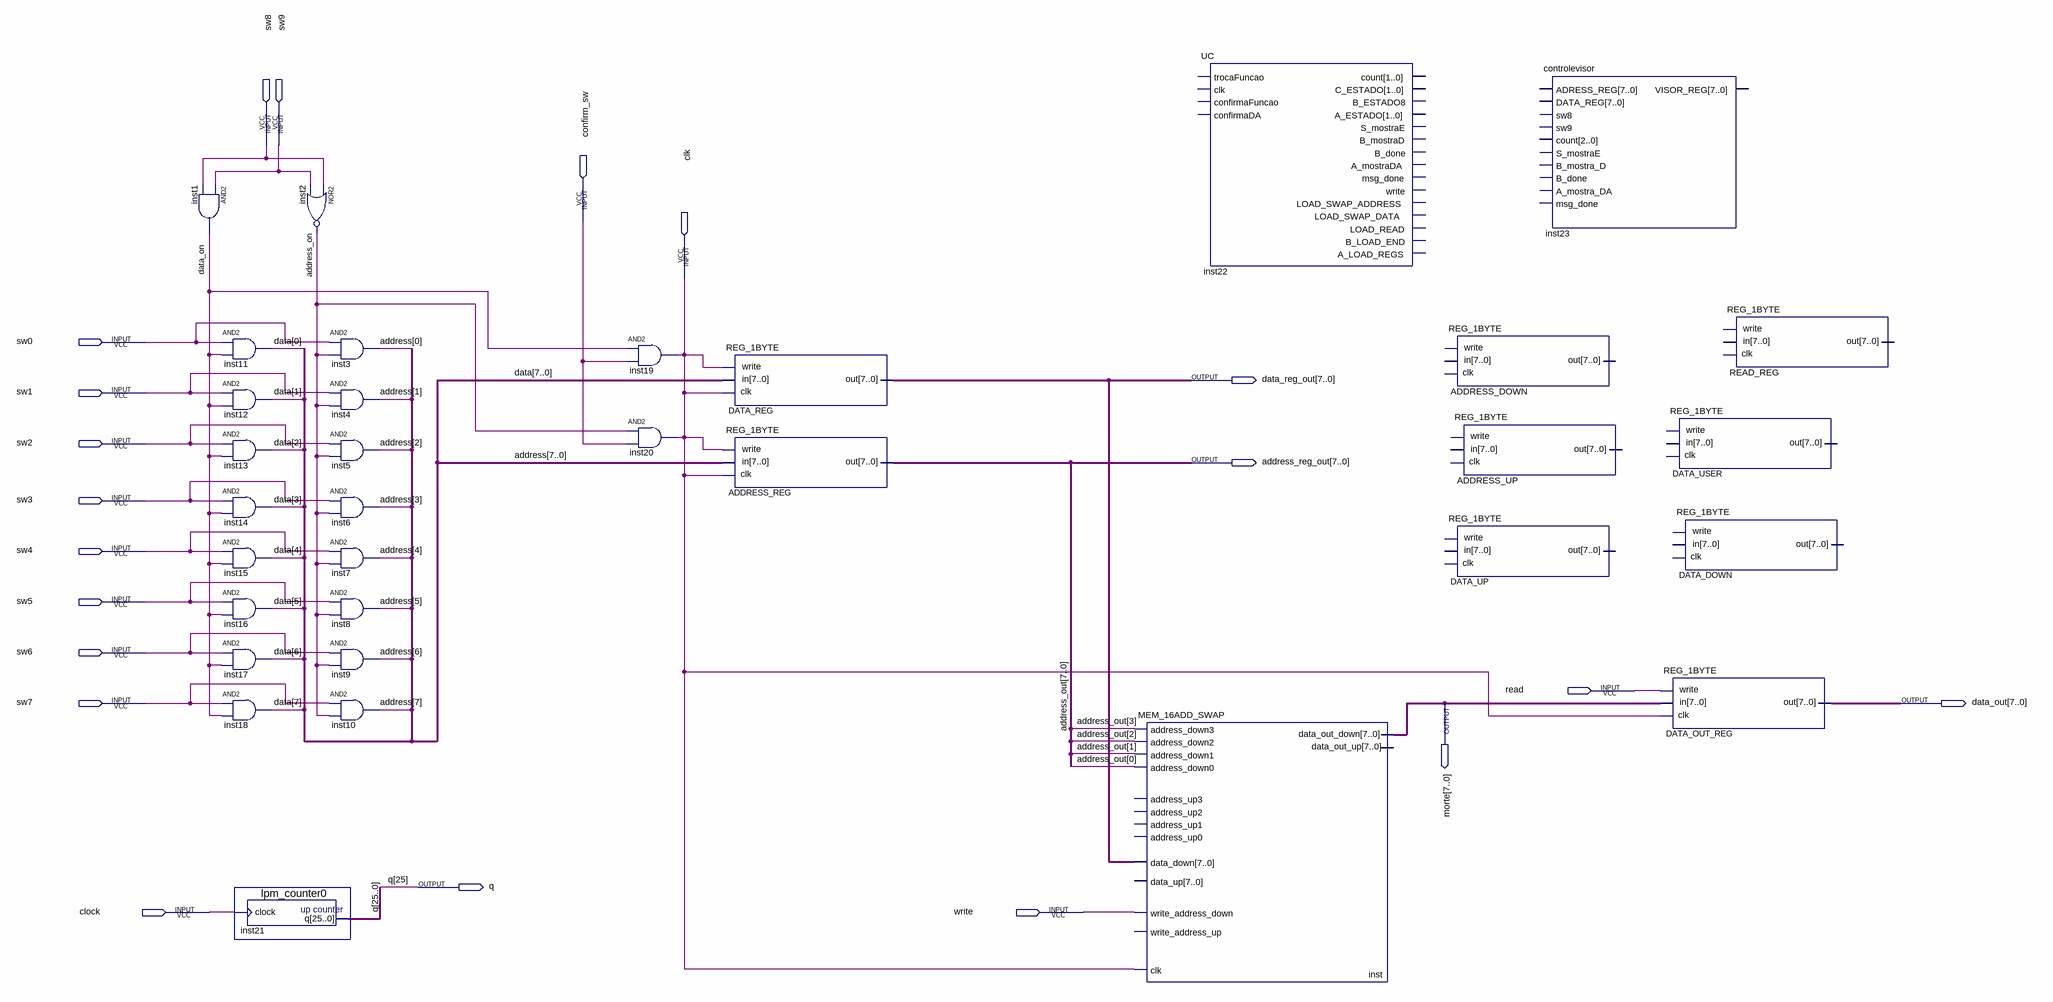
[diagram p0: schematic sheet]
// Quartus schematic trabalhofinal_swap.bdf as structural Verilog: 33 symbols, 20 pins
module trabalhofinal_swap (
  input  sw8,
  input  sw9,
  input  confirm_sw,
  input  clk,
  input  sw0,
  input  sw1,
  input  sw2,
  input  sw3,
  input  sw4,
  input  sw5,
  input  sw6,
  input  read,
  input  sw7,
  input  clock,
  input  write,
  output [7:0] data_reg_out,
  output [7:0] address_reg_out,
  output [7:0] morte,
  output [7:0] data_out,
  output q
);

  wire address_on, data_on;
  wire [7:0] address, data;
  wire [24:0] q_bus;

  and inst1 (data_on, sw9, sw8);
  and inst11 (data[0], sw0, data_on);
  and inst12 (data[1], sw1, data_on);
  and inst13 (data[2], sw2, data_on);
  and inst14 (data[3], sw3, data_on);
  and inst15 (data[4], sw4, data_on);
  and inst16 (data[5], sw5, data_on);
  and inst17 (data[6], sw6, data_on);
  and inst18 (data[7], sw7, data_on);
  lpm_counter0 inst21 (.clock(clock), .q({q, q_bus}));
  nor inst2 (address_on, sw8, sw9);
  and inst3 (address[0], sw0, address_on);
  and inst4 (address[1], sw1, address_on);
  and inst5 (address[2], sw2, address_on);
  and inst6 (address[3], sw3, address_on);
  and inst7 (address[4], sw4, address_on);
  and inst8 (address[5], sw5, address_on);
  and inst9 (address[6], sw6, address_on);
  and inst10 (address[7], sw7, address_on);
  and inst19 (clk, data_on, confirm_sw);
  and inst20 (clk, address_on, confirm_sw);
  REG_1BYTE DATA_REG (.write(clk), .clk(clk), .in(data), .out(data_reg_out));
  REG_1BYTE ADDRESS_REG (.write(clk), .clk(clk), .in(address), .out(address_reg_out));
  MEM_16ADD_SWAP inst (
    .address_down0(address_reg_out[0]), .address_down1(address_reg_out[1]),
    .address_down2(address_reg_out[2]), .address_down3(address_reg_out[3]), .data_down(data_reg_out),
    .clk(clk), .write_address_down(write), .data_out_down(morte));  // open: address_up0, address_up1, address_up2, address_up3, data_up, write_address_up, data_out_up
  UC inst22 ();  // open: trocaFuncao, clk, confirmaFuncao, confirmaDA, count, C_ESTADO, B_ESTADO8, A_ESTADO, S_mostraE, B_mostraD, B_done, A_mostraDA, msg_done, write, LOAD_SWAP_ADDRESS, LOAD_SWAP_DATA, LOAD_READ, B_LOAD_END, A_LOAD_REGS
  REG_1BYTE ADDRESS_DOWN ();  // open: write, clk, in, out
  REG_1BYTE ADDRESS_UP ();  // open: write, clk, in, out
  REG_1BYTE DATA_UP ();  // open: write, clk, in, out
  controlevisor inst23 ();  // open: ADRESS_REG, DATA_REG, sw8, sw9, count, S_mostraE, B_mostra_D, B_done, A_mostra_DA, msg_done, VISOR_REG
  REG_1BYTE DATA_USER ();  // open: write, clk, in, out
  REG_1BYTE DATA_DOWN ();  // open: write, clk, in, out
  REG_1BYTE DATA_OUT_REG (.write(read), .clk(clk), .in(morte), .out(data_out));
  REG_1BYTE READ_REG ();  // open: write, clk, in, out

  // Other names for the same wires on the sheet: address_out[7:0] = address_reg_out; q[25] = q
endmodule
